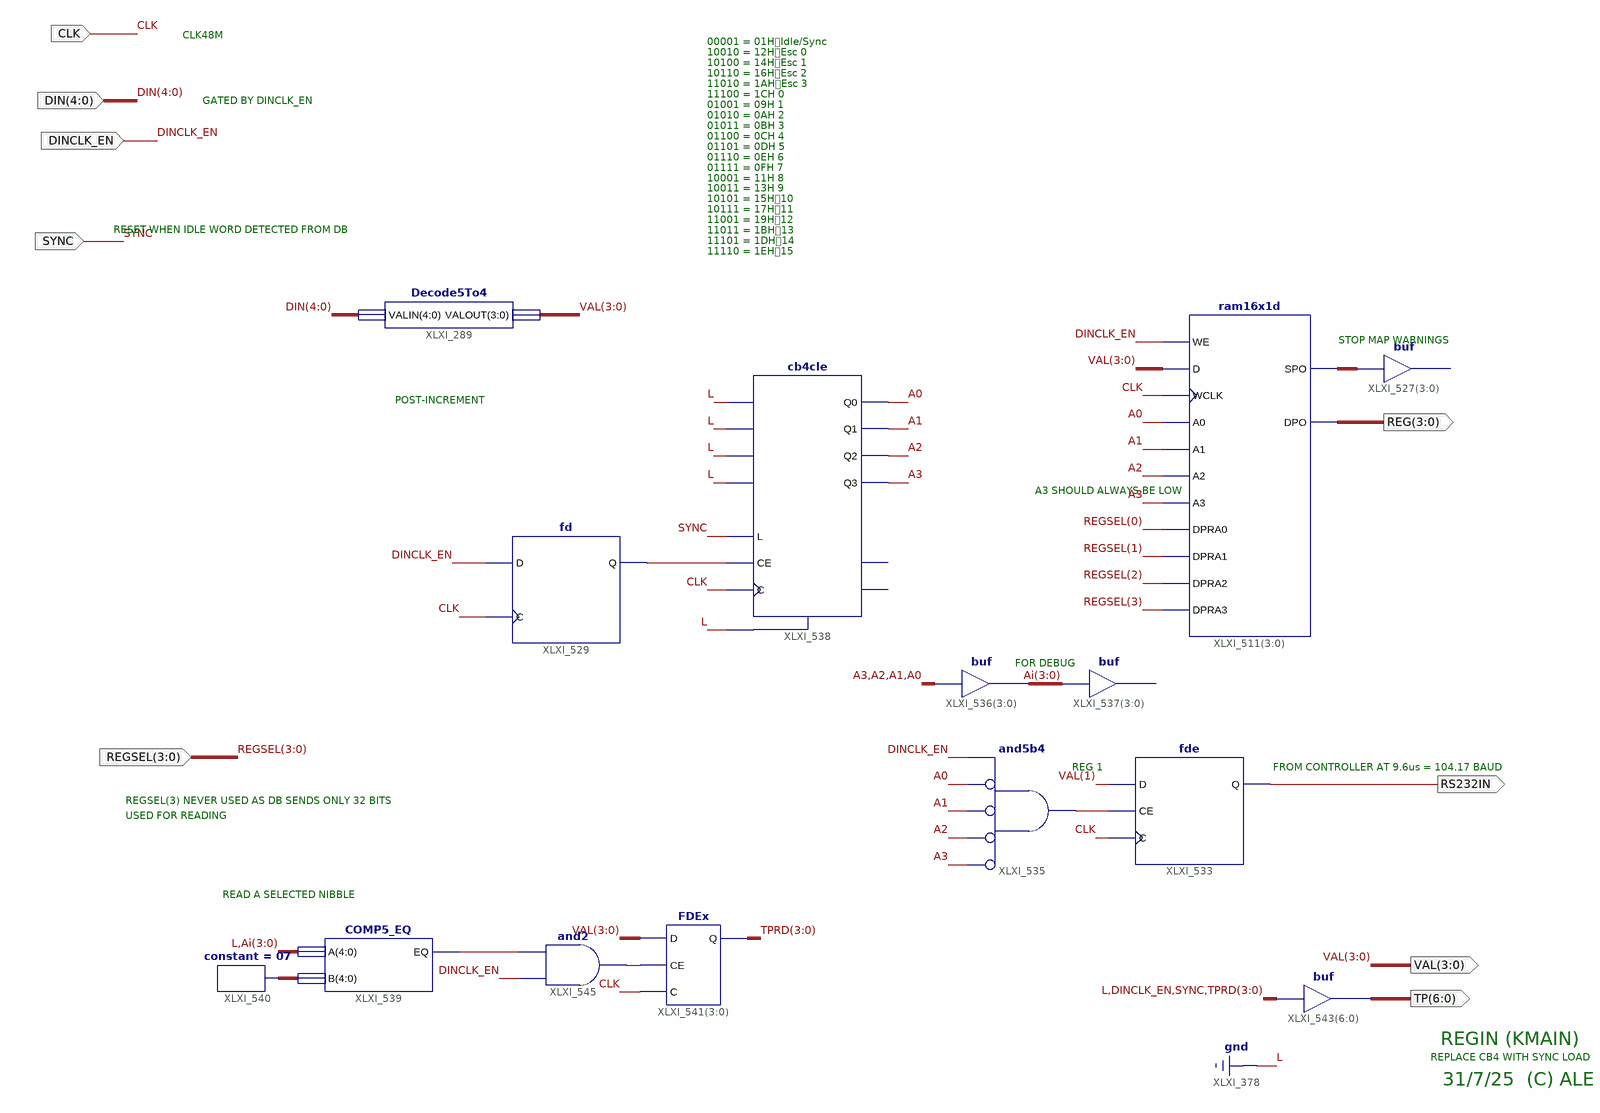
[diagram p0: schematic sheet 1]
// Xilinx ISE schematic RegIn.sch (spartan6) as structural Verilog: 14 symbols, 9 ports
module RegIn (
  input  [4:0] DIN,
  input  [3:0] REGSEL,
  input  CLK,
  input  DINCLK_EN,
  input  SYNC,
  output [3:0] VAL,
  output [3:0] REG,
  output RS232IN,
  output [6:0] TP
);

  wire A0, A1, A2, A3, TPLAT, XLXN_371, XLXN_377, XLXN_389;
  wire [3:0] Ai, TPRD, XLXN_362;
  wire [4:0] XLXN_379;

  ram16x1d XLXI_511[3:0] (
    .A0(A0), .A1(A1), .A2(A2), .A3(A3), .D(VAL), .DPRA0(REGSEL[0]), .DPRA1(REGSEL[1]), .DPRA2(REGSEL[2]),
    .DPRA3(REGSEL[3]), .WCLK(CLK), .WE(DINCLK_EN), .DPO(REG), .SPO(XLXN_362));
  // buf XLXI_527[3..0] has open pins: I=XLXN_362, O=open
  fd XLXI_529 (.C(CLK), .D(DINCLK_EN), .Q(XLXN_371));
  Decode5To4 XLXI_289 (.VALIN(DIN), .VALOUT(VAL));
  fde XLXI_533 (.C(CLK), .CE(XLXN_377), .D(VAL[1]), .Q(RS232IN));
  and XLXI_535 (XLXN_377, ~A3, ~A2, ~A1, ~A0, DINCLK_EN);  // and5b4
  assign Ai = {A3, A2, A1, A0};  // buf XLXI_536[3..0], 4 bits wide
  // buf XLXI_537[3..0] has open pins: I=Ai, O=open
  cb4cle XLXI_538 (
    .C(CLK), .CE(XLXN_371), .CLR(1'b0), .D0(1'b0), .D1(1'b0), .D2(1'b0), .D3(1'b0), .L(SYNC), .Q0(A0),
    .Q1(A1), .Q2(A2), .Q3(A3));  // open: CEO, TC
  COMP5_EQ XLXI_539 (.A({1'b0, Ai}), .B(XLXN_379), .EQ(XLXN_389));
  constant #(.CValue("07")) XLXI_540 (.O(XLXN_379));
  assign TP = {1'b0, DINCLK_EN, SYNC, TPRD};  // buf XLXI_543[6..0], 7 bits wide
  FDEx XLXI_541[3:0] (.C(CLK), .CE(TPLAT), .D(VAL), .Q(TPRD));
  and XLXI_545 (TPLAT, DINCLK_EN, XLXN_389);

  // Notes on the sheet:
  //   CLK48M
  //   00001 = 01H	Idle/Sync
  //   10010 = 12H	Esc 0
  //   10100 = 14H	Esc 1
  //   10110 = 16H	Esc 2
  //   11010 = 1AH	Esc 3
  //   11100 = 1CH 0
  //   GATED BY DINCLK_EN
  //   01001 = 09H 1
  //   01010 = 0AH 2
  //   01011 = 0BH 3
  //   01100 = 0CH 4
  //   01101 = 0DH 5
  //   01110 = 0EH 6
  //   01111 = 0FH 7
  //   10001 = 11H 8
  //   10011 = 13H 9
  //   10101 = 15H	10
  //   10111 = 17H	11
  //   11001 = 19H	12
  //   RESET WHEN IDLE WORD DETECTED FROM DB
  //   11011 = 1BH	13
  //   11101 = 1DH	14
  //   11110 = 1EH	15
  //   STOP MAP WARNINGS
  //   POST-INCREMENT
  //   A3 SHOULD ALWAYS BE LOW
  //   FOR DEBUG
  //   REG 1
  //   FROM CONTROLLER AT 9.6us = 104.17 BAUD
  //   REGSEL(3) NEVER USED AS DB SENDS ONLY 32 BITS
  //   USED FOR READING
  //   READ A SELECTED NIBBLE
  //   REGIN (KMAIN)
  //   REPLACE CB4 WITH SYNC LOAD
  //   31/7/25  (C) ALE
endmodule
